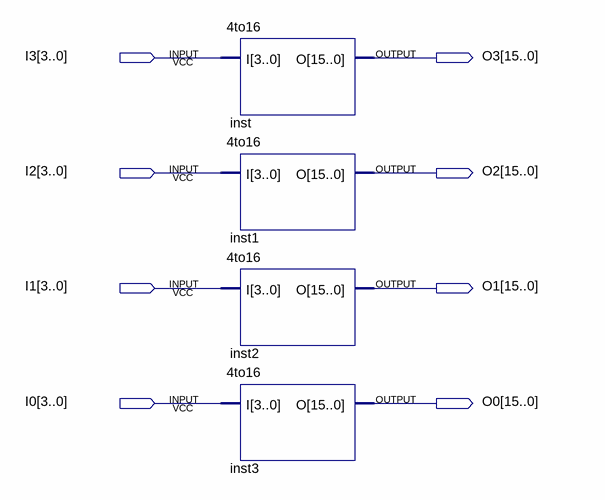
[diagram p0: schematic sheet]
// Quartus schematic 4to16f4.bdf as structural Verilog: 4 symbols, 8 pins
module \4to16f4  (
  input  [3:0] I3,
  input  [3:0] I2,
  input  [3:0] I1,
  input  [3:0] I0,
  output [15:0] O3,
  output [15:0] O2,
  output [15:0] O1,
  output [15:0] O0
);

  \4to16  inst (.I(I3), .O(O3));
  \4to16  inst1 (.I(I2), .O(O2));
  \4to16  inst2 (.I(I1), .O(O1));
  \4to16  inst3 (.I(I0), .O(O0));
endmodule
